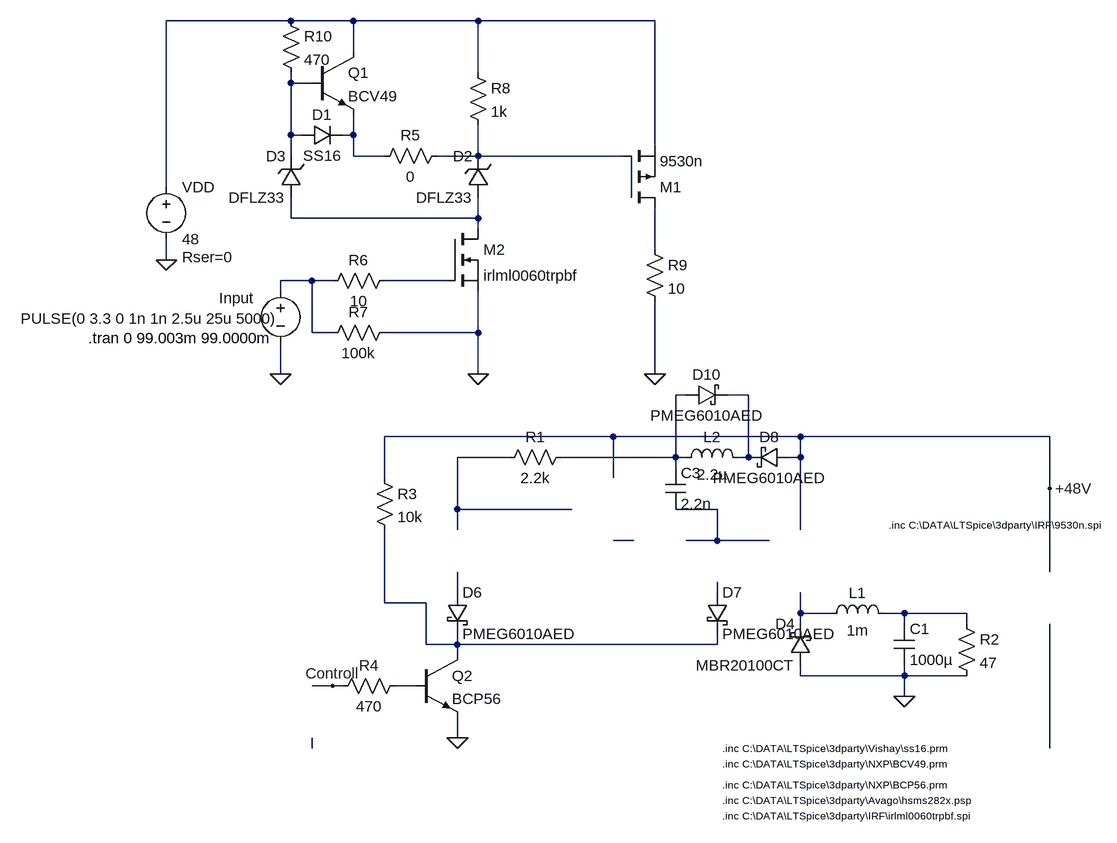
[diagram p0: schematic test001.asc]
test001.asc, the LTspice schematic file:
Version 4
SHEET 1 908 680
WIRE -400 -720 -592 -720
WIRE -304 -720 -400 -720
WIRE -112 -720 -304 -720
WIRE 160 -720 -112 -720
WIRE -304 -672 -304 -720
WIRE -112 -640 -112 -720
WIRE -400 -624 -400 -640
WIRE -368 -624 -400 -624
WIRE -400 -544 -400 -624
WIRE -384 -544 -400 -544
WIRE -304 -544 -304 -576
WIRE -304 -544 -320 -544
WIRE 160 -528 160 -720
WIRE -400 -512 -400 -544
WIRE -304 -512 -304 -544
WIRE -256 -512 -304 -512
WIRE -112 -512 -112 -560
WIRE -112 -512 -176 -512
WIRE 112 -512 -112 -512
WIRE -592 -464 -592 -720
WIRE -400 -416 -400 -448
WIRE -112 -416 -112 -448
WIRE -112 -416 -400 -416
WIRE -112 -400 -112 -416
WIRE 160 -368 160 -432
WIRE -592 -352 -592 -384
WIRE -368 -320 -416 -320
WIRE -336 -320 -368 -320
WIRE -160 -320 -256 -320
WIRE -416 -304 -416 -320
WIRE -368 -240 -368 -320
WIRE -336 -240 -368 -240
WIRE -112 -240 -112 -304
WIRE -112 -240 -256 -240
WIRE -416 -176 -416 -224
WIRE -112 -176 -112 -240
WIRE 160 -176 160 -288
WIRE 208 -144 192 -144
WIRE 304 -144 272 -144
WIRE 96 -80 -256 -80
WIRE 384 -80 96 -80
WIRE 768 -80 384 -80
WIRE -64 -48 -144 -48
WIRE 192 -48 192 -144
WIRE 192 -48 16 -48
WIRE 208 -48 192 -48
WIRE 304 -48 304 -144
WIRE 304 -48 288 -48
WIRE 384 -48 384 -80
WIRE 384 -48 368 -48
WIRE 192 -32 192 -48
WIRE -256 -16 -256 -80
WIRE 96 -16 96 -80
WIRE 768 0 768 -80
WIRE -144 32 -144 -48
WIRE 32 32 -144 32
WIRE 256 32 192 32
WIRE -144 64 -144 32
WIRE 384 64 384 -48
WIRE 128 80 96 80
WIRE 256 80 256 32
WIRE 256 80 208 80
WIRE 336 80 256 80
WIRE 768 128 768 0
WIRE -144 160 -144 128
WIRE 256 160 256 144
WIRE -256 176 -256 64
WIRE -192 176 -256 176
WIRE 384 192 384 160
WIRE 432 192 384 192
WIRE 544 192 512 192
WIRE 640 192 544 192
WIRE 384 208 384 192
WIRE 544 208 544 192
WIRE 640 208 640 192
WIRE -192 240 -192 176
WIRE -144 240 -144 224
WIRE -144 240 -192 240
WIRE 256 240 256 224
WIRE 256 240 -144 240
WIRE -144 256 -144 240
WIRE 384 288 384 272
WIRE 544 288 544 272
WIRE 544 288 384 288
WIRE 640 288 544 288
WIRE -336 304 -368 304
WIRE -320 304 -336 304
WIRE -208 304 -240 304
WIRE 544 320 544 288
WIRE -144 384 -144 352
WIRE -368 400 -368 384
WIRE 768 400 768 208
FLAG -144 384 0
FLAG -592 -352 0
FLAG -416 -176 0
FLAG 768 0 +48V
FLAG -336 304 Controll
FLAG 544 320 0
FLAG -112 -176 0
FLAG 160 -176 0
SYMBOL pmos 112 -432 M180
SYMATTR InstName M1
SYMATTR Value 9530n
SYMATTR Prefix X
SYMBOL npn -368 -672 R0
SYMATTR InstName Q1
SYMATTR Value BCV49
SYMATTR Prefix X
SYMBOL npn -208 256 R0
SYMATTR InstName Q2
SYMATTR Value BCP56
SYMATTR Prefix X
SYMBOL res 32 -64 R90
WINDOW 0 0 56 VBottom 2
WINDOW 3 32 56 VTop 2
SYMATTR InstName R1
SYMATTR Value 2.2k
SYMBOL res -224 288 R90
WINDOW 0 0 56 VBottom 2
WINDOW 3 32 56 VTop 2
SYMATTR InstName R4
SYMATTR Value 470
SYMBOL voltage -592 -480 R0
WINDOW 123 0 0 Left 2
WINDOW 39 24 124 Left 2
SYMATTR SpiceLine Rser=0
SYMATTR InstName VDD
SYMATTR Value 48
SYMBOL voltage -416 -320 R0
WINDOW 0 -95 27 Left 2
WINDOW 3 -400 58 Left 2
SYMATTR InstName Input
SYMATTR Value PULSE(0 3.3 0 1n 1n 2.5u 25u 5000)
SYMBOL zener -96 -448 R180
WINDOW 0 24 64 Left 2
WINDOW 3 24 0 Left 2
SYMATTR InstName D2
SYMATTR Value DFLZ33
SYMBOL zener -384 -448 R180
WINDOW 0 24 64 Left 2
WINDOW 3 24 0 Left 2
SYMATTR InstName D3
SYMATTR Value DFLZ33
SYMBOL schottky 400 272 R180
WINDOW 0 24 64 Left 2
WINDOW 3 24 0 Left 2
SYMATTR InstName D4
SYMATTR Value MBR20100CT
SYMATTR Description Diode
SYMATTR Type diode
SYMBOL ind 416 208 R270
WINDOW 0 32 56 VTop 2
WINDOW 3 5 56 VBottom 2
SYMATTR InstName L1
SYMATTR Value 1m
SYMATTR SpiceLine Rser=90m
SYMBOL cap 528 208 R0
SYMATTR InstName C1
SYMATTR Value 1000µ
SYMATTR SpiceLine Rser=20m
SYMBOL res 624 192 R0
SYMATTR InstName R2
SYMATTR Value 47
SYMBOL schottky -160 160 R0
SYMATTR InstName D6
SYMATTR Value PMEG6010AED
SYMATTR Description Diode
SYMATTR Type diode
SYMBOL res -272 -32 R0
SYMATTR InstName R3
SYMATTR Value 10k
SYMBOL schottky 240 160 R0
SYMATTR InstName D7
SYMATTR Value PMEG6010AED
SYMATTR Description Diode
SYMATTR Type diode
SYMBOL cap 176 -32 R0
SYMATTR InstName C3
SYMATTR Value 2.2n
SYMBOL schottky 368 -64 R90
WINDOW 0 0 32 VBottom 2
WINDOW 3 32 32 VTop 2
SYMATTR InstName D8
SYMATTR Value PMEG6010AED
SYMATTR Description Diode
SYMATTR Type diode
SYMBOL res -160 -528 R90
WINDOW 0 0 56 VBottom 2
WINDOW 3 32 56 VTop 2
SYMATTR InstName R5
SYMATTR Value 0
SYMBOL ind 192 -32 R270
WINDOW 0 32 56 VTop 2
WINDOW 3 5 56 VBottom 2
SYMATTR InstName L2
SYMATTR Value 2.2µ
SYMATTR SpiceLine Rser=1
SYMBOL schottky 208 -128 R270
WINDOW 0 32 32 VTop 2
WINDOW 3 0 32 VBottom 2
SYMATTR InstName D10
SYMATTR Value PMEG6010AED
SYMATTR Description Diode
SYMATTR Type diode
SYMBOL res -240 -336 R90
WINDOW 0 0 56 VBottom 2
WINDOW 3 32 56 VTop 2
SYMATTR InstName R6
SYMATTR Value 10
SYMBOL nmos -160 -400 R0
SYMATTR InstName M2
SYMATTR Value irlml0060trpbf
SYMATTR Prefix X
SYMBOL res -240 -256 R90
WINDOW 0 0 56 VBottom 2
WINDOW 3 32 56 VTop 2
SYMATTR InstName R7
SYMATTR Value 100k
SYMBOL res -128 -656 R0
SYMATTR InstName R8
SYMATTR Value 1k
SYMBOL res 144 -384 R0
SYMATTR InstName R9
SYMATTR Value 10
SYMBOL res -416 -736 R0
SYMATTR InstName R10
SYMATTR Value 470
SYMBOL diode -384 -528 R270
WINDOW 0 32 32 VTop 2
WINDOW 3 0 32 VBottom 2
SYMATTR InstName D1
SYMATTR Value SS16
SYMATTR Prefix X
TEXT 520 56 Left 1 !.inc C:\\DATA\\LTSpice\\3dparty\\IRF\\9530n.spi
TEXT -712 -232 Left 2 !.tran 0 99.003m 99.0000m
TEXT 264 456 Left 1 !.inc C:\\DATA\\LTSpice\\3dparty\\NXP\\BCP56.prm
TEXT 264 480 Left 1 !.inc C:\\DATA\\LTSpice\\3dparty\\Avago\\hsms282x.psp
TEXT 264 424 Left 1 !.inc C:\\DATA\\LTSpice\\3dparty\\NXP\\BCV49.prm
TEXT 264 400 Left 1 !.inc C:\\DATA\\LTSpice\\3dparty\\Vishay\\ss16.prm
TEXT 264 504 Left 1 !.inc C:\\DATA\\LTSpice\\3dparty\\IRF\\irlml0060trpbf.spi

The netlist it stands for:
* test001.asc
XM1 N006 N004 N001 9530n  ; pins D G S
XQ1 N001 N002 N003 BCV49  ; pins C B E
XQ2 N016 N019 0 BCP56  ; pins C B E
R1 N009 N011 2.2k
R4 N019 Controll 470
VDD N001 0 48 Rser=0
V§Input N007 0 PULSE(0 3.3 0 1n 1n 2.5u 25u 5000)
D2 N005 N004 DFLZ33
D3 N005 N002 DFLZ33
D4 0 N017 MBR20100CT
L1 N017 N018 1m Rser=90m
C1 N018 0 1000µ Rser=20m
R2 N018 0 47
D6 N014 N016 PMEG6010AED
R3 +48V N016 10k
D7 N015 N016 PMEG6010AED
C3 N009 N012 2.2n
D8 +48V N010 PMEG6010AED
R5 N004 N003 0
L2 N009 N010 2.2µ Rser=1
D10 N009 N010 PMEG6010AED
R6 N008 N007 10
XM2 N005 N008 0 irlml0060trpbf  ; pins D G S
R7 0 N007 100k
R8 N001 N004 1k
R9 N006 0 10
R10 N001 N002 470
XD1 N002 N003 SS16  ; pins + -
.model D D
.lib standard.dio
.inc C:\DATA\LTSpice\3dparty\IRF\9530n.spi
.tran 0 99.003m 99.0000m
.inc C:\DATA\LTSpice\3dparty\NXP\BCP56.prm
.inc C:\DATA\LTSpice\3dparty\Avago\hsms282x.psp
.inc C:\DATA\LTSpice\3dparty\NXP\BCV49.prm
.inc C:\DATA\LTSpice\3dparty\Vishay\ss16.prm
.inc C:\DATA\LTSpice\3dparty\IRF\irlml0060trpbf.spi
.backanno
.end